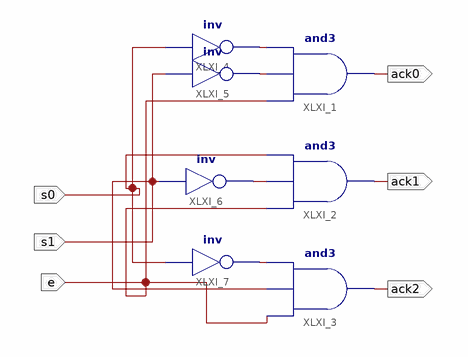
[diagram p0: schematic sheet 1]
// Xilinx ISE schematic decoder.sch (artix7) as structural Verilog: 7 symbols, 6 ports
module decoder (
  input  s0,
  input  s1,
  input  e,
  output ack0,
  output ack1,
  output ack2
);

  wire XLXN_7, XLXN_8, XLXN_9, XLXN_10;

  and XLXI_1 (ack0, e, XLXN_8, XLXN_7);
  and XLXI_2 (ack1, e, XLXN_9, s0);
  and XLXI_3 (ack2, e, s1, XLXN_10);
  not XLXI_4 (XLXN_7, s0);
  not XLXI_5 (XLXN_8, s1);
  not XLXI_6 (XLXN_9, s1);
  not XLXI_7 (XLXN_10, s0);
endmodule
